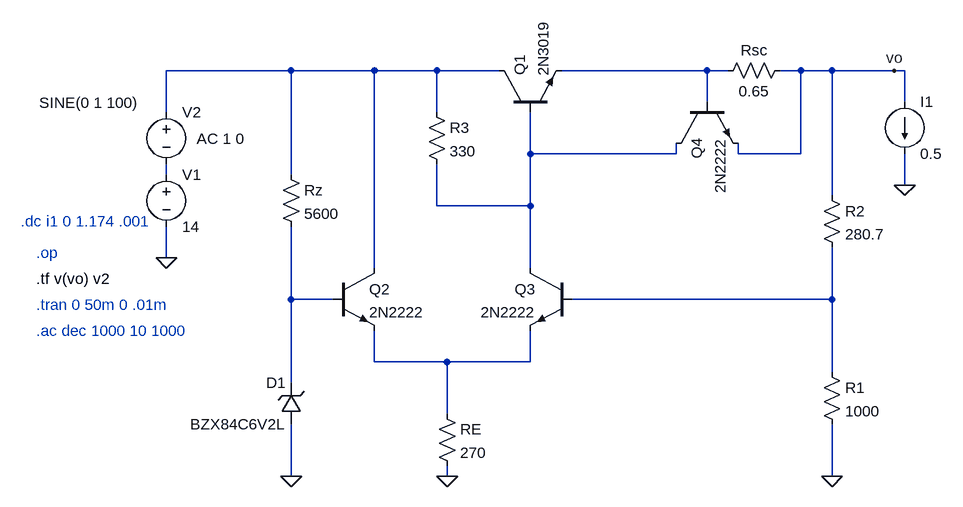
[diagram p0: schematic regulador clase 2.asc]
regulador clase 2.asc, the LTspice schematic file:
Version 4
SHEET 1 1232 680
WIRE 224 -48 32 -48
WIRE 352 -48 224 -48
WIRE 448 -48 352 -48
WIRE 544 -48 448 -48
WIRE 864 -48 640 -48
WIRE 896 -48 864 -48
WIRE 1008 -48 976 -48
WIRE 1056 -48 1008 -48
WIRE 1152 -48 1056 -48
WIRE 1168 -48 1152 -48
WIRE 864 0 864 -48
WIRE 1168 0 1168 -48
WIRE 32 16 32 -48
WIRE 448 16 448 -48
WIRE 592 80 592 16
WIRE 816 80 816 64
WIRE 816 80 592 80
WIRE 912 80 912 64
WIRE 1008 80 1008 -48
WIRE 1008 80 912 80
WIRE 32 112 32 96
WIRE 224 112 224 -48
WIRE 1168 128 1168 80
WIRE 1056 144 1056 -48
WIRE 448 160 448 96
WIRE 592 160 592 80
WIRE 592 160 448 160
WIRE 32 240 32 192
WIRE 352 256 352 -48
WIRE 592 256 592 160
WIRE 224 304 224 192
WIRE 288 304 224 304
WIRE 1056 304 1056 224
WIRE 1056 304 656 304
WIRE 352 400 352 352
WIRE 464 400 352 400
WIRE 592 400 592 352
WIRE 592 400 464 400
WIRE 1056 416 1056 304
WIRE 224 432 224 304
WIRE 464 480 464 400
WIRE 224 576 224 496
WIRE 464 576 464 560
WIRE 1056 576 1056 496
FLAG 32 240 0
FLAG 464 576 0
FLAG 224 576 0
FLAG 1056 576 0
FLAG 1168 128 0
FLAG 1152 -48 vo
DATAFLAG 448 -48 ""
DATAFLAG 592 160 ""
DATAFLAG 464 400 ""
DATAFLAG 1056 304 ""
DATAFLAG 224 304 ""
DATAFLAG 1104 -48 ""
SYMBOL voltage 32 96 R0
WINDOW 123 0 0 Left 2
WINDOW 39 0 0 Left 2
SYMATTR InstName V1
SYMATTR Value 14
SYMBOL voltage 32 0 R0
WINDOW 123 47 57 Left 2
WINDOW 39 0 0 Left 2
WINDOW 3 -196 1 Left 2
SYMATTR Value2 AC 1 0
SYMATTR Value SINE(0 1 100)
SYMATTR InstName V2
SYMBOL npn 544 16 R270
SYMATTR InstName Q1
SYMATTR Value 2N3019
SYMBOL npn 288 256 R0
SYMATTR InstName Q2
SYMATTR Value 2N2222
SYMBOL npn 656 256 M0
SYMATTR InstName Q3
SYMATTR Value 2N2222
SYMBOL res 432 0 R0
SYMATTR InstName R3
SYMATTR Value 330
SYMBOL res 448 464 R0
SYMATTR InstName RE
SYMATTR Value 270
SYMBOL res 208 96 R0
SYMATTR InstName Rz
SYMATTR Value 5600
SYMBOL zener 240 496 R180
WINDOW 0 24 64 Left 2
WINDOW 3 24 0 Left 2
SYMATTR InstName D1
SYMATTR Value BZX84C6V2L
SYMATTR Description Diode
SYMATTR Type diode
SYMBOL res 1040 128 R0
SYMATTR InstName R2
SYMATTR Value 280.7
SYMBOL res 1040 400 R0
SYMATTR InstName R1
SYMATTR Value 1000
SYMBOL npn 816 0 M90
SYMATTR InstName Q4
SYMATTR Value 2N2222
SYMBOL res 992 -64 R90
WINDOW 0 0 56 VBottom 2
WINDOW 3 32 56 VTop 2
SYMATTR InstName Rsc
SYMATTR Value 0.65
SYMBOL current 1168 0 R0
WINDOW 123 0 0 Left 0
WINDOW 39 0 0 Left 0
SYMATTR InstName I1
SYMATTR Value 0.5
TEXT -168 232 Left 2 ;.op
TEXT -168 312 Left 2 ;.tran 0 50m 0 .01m
TEXT -168 272 Left 2 !.tf v(vo) v2
TEXT -168 352 Left 2 ;.ac dec 1000 10 1000
TEXT -192 184 Left 2 ;.dc i1 0 1.174 .001

The netlist it stands for:
* regulador clase 2.asc
V1 N004 0 14
V2 N001 N004 SINE(0 1 100) AC 1 0
Q1 N001 N003 N002 0 2N3019
Q2 N001 N005 N007 0 2N2222
Q3 N003 N006 N007 0 2N2222
R3 N001 N003 330
RE N007 0 270
Rz N001 N005 5600
D1 0 N005 BZX84C6V2L
R2 vo N006 280.7
R1 N006 0 1000
Q4 N003 N002 vo 0 2N2222
Rsc vo N002 0.65
I1 vo 0 0.5
.model D D
.lib standard.dio
.model NPN NPN
.model PNP PNP
.lib standard.bjt
* .op
* .tran 0 50m 0 .01m
.tf v(vo) v2
* .ac dec 1000 10 1000
* .dc i1 0 1.174 .001
.backanno
.end